# Altium schematic sheet Regulators_2.SchDoc: Regulators_2
size B; Organization: Myomo; Address1: 137 PORTLAND STREET, 4TH FLOOR; Address2: BOSTON, MA 02114; Address3: USA; SheetNumber: 3
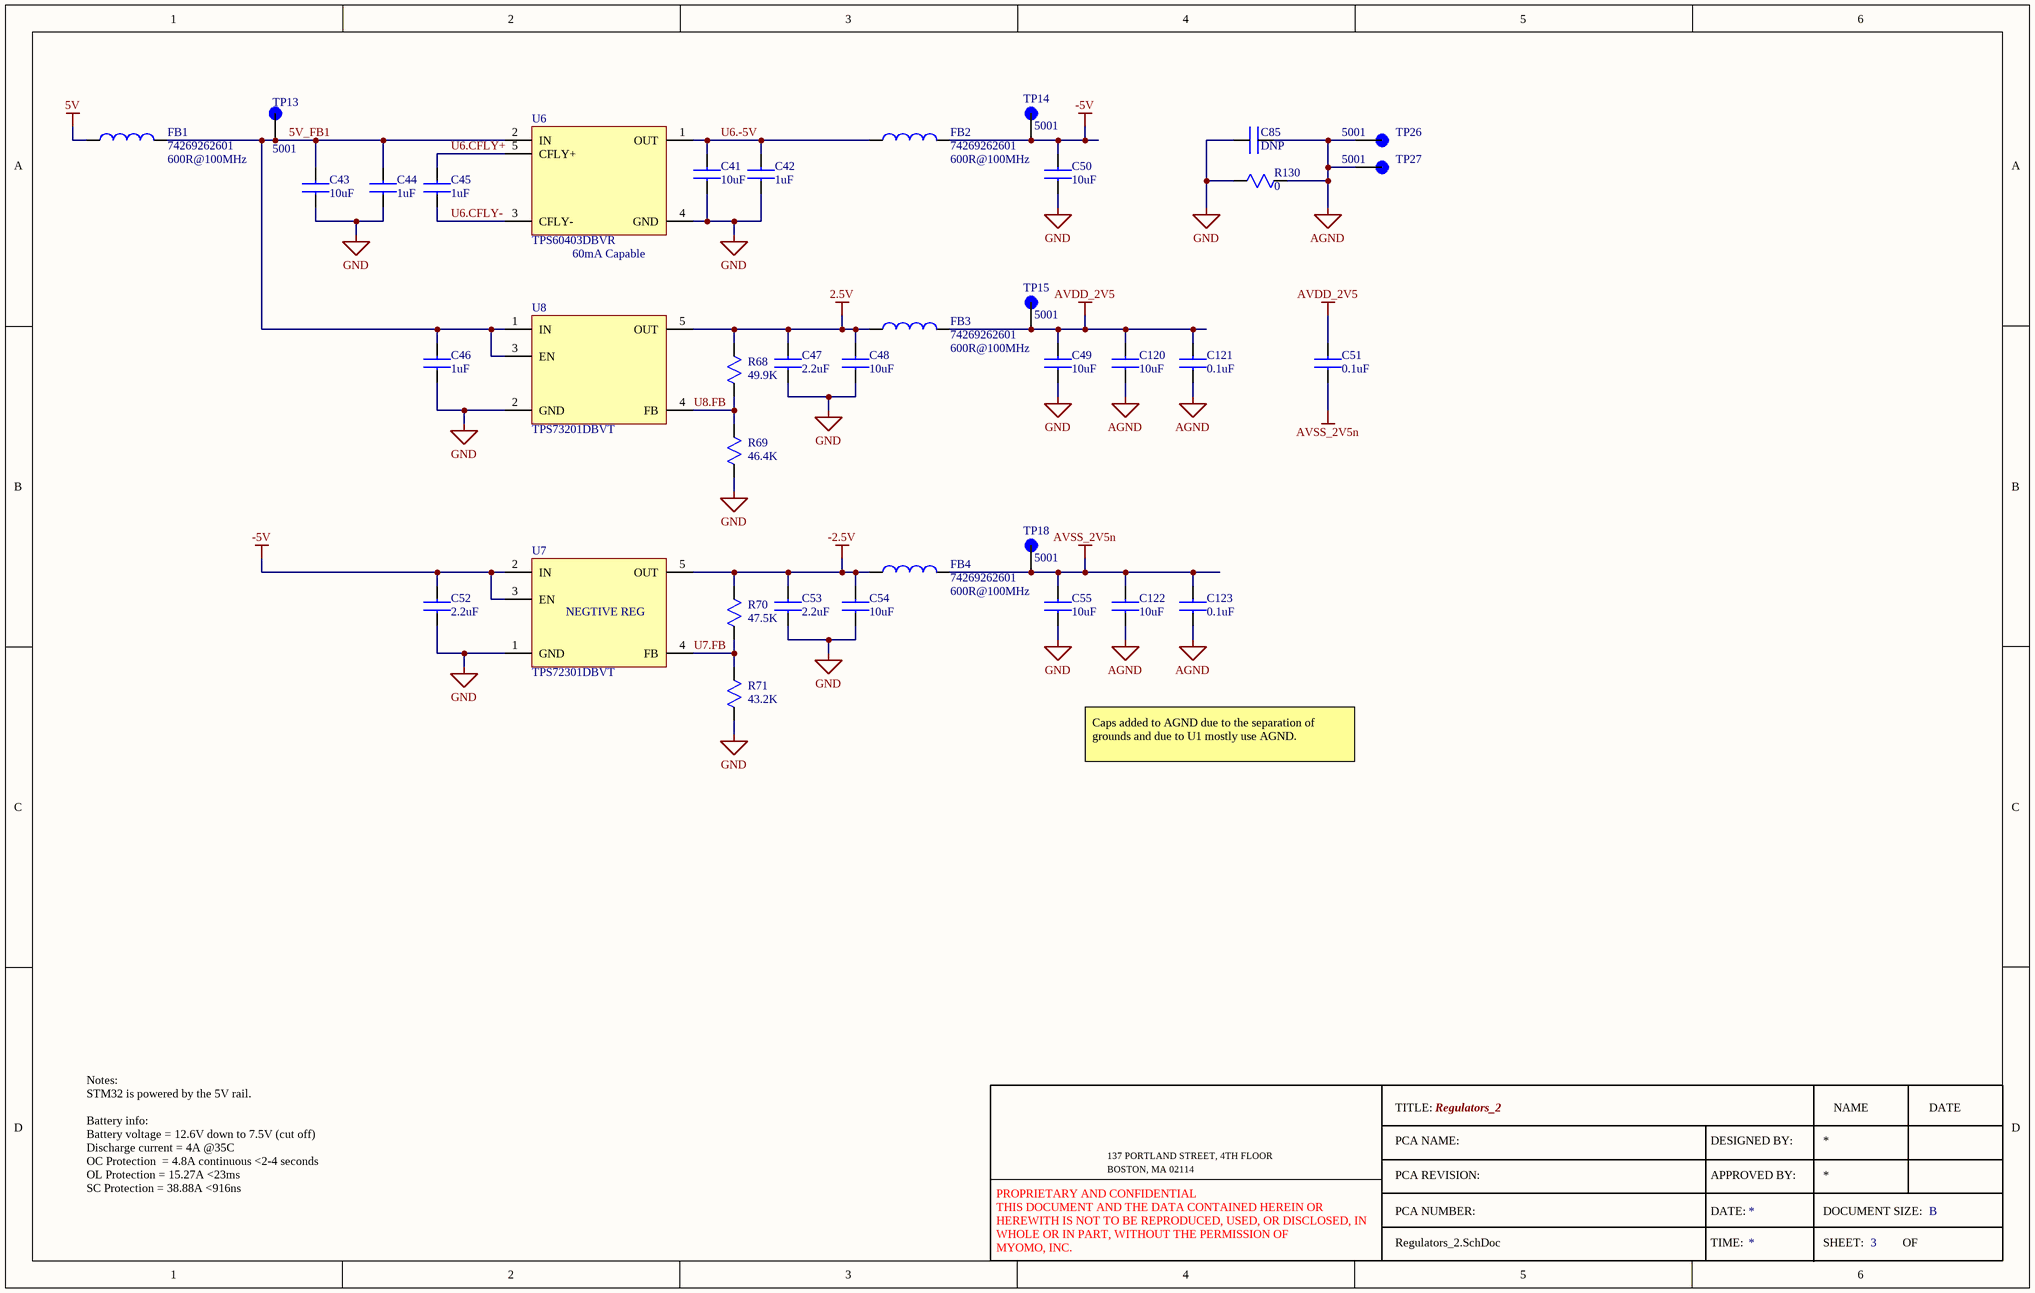
[diagram p0: Regulators_2.SchDoc]

## Parts
C41  10uF  [1210]
C42  1uF  [0603]
C43  10uF  [1210]
C44  1uF  [0603]
C45  1uF  [0603]
C46  1uF  [0603]
C47  2.2uF  [0603]
C48  10uF  [1210]
C49  10uF  [1210]
C50  10uF  [1210]
C51  0.1uF  [0603]
C52  2.2uF  [0603]
C53  2.2uF  [0603]
C54  10uF  [1210]
C55  10uF  [1210]
C85  DNP  [0603]  (no BOM)
C120  10uF  [1210]
C121  0.1uF  [0603]
C122  10uF  [1210]
C123  0.1uF  [0603]
FB1  74269262601  [0603]
FB2  74269262601  [0603]
FB3  74269262601  [0603]
FB4  74269262601  [0603]
R68  49.9K  [0603]
R69  46.4K  [0603]
R70  47.5K  [0603]
R71  43.2K  [0603]
R130  0  [0603]
TP13  5001  [TP_CLIP_BLK_5001]
TP14  5001  [TP_CLIP_BLK_5001]
TP15  5001  [TP_CLIP_BLK_5001]
TP18  5001  [TP_CLIP_BLK_5001]
TP26  5001  [TP_CLIP_BLK_5001]
TP27  5001  [TP_CLIP_BLK_5001]
U6  TPS60403DBVR  [U_TPS60403DBVR]
U7  TPS72301DBVT  [U_TPS72301DBVT_NEG]
U8  TPS73201DBVT  [U_TPS73201DBVT]

## Nets
2.5V: C47.1 C48.1 FB3.1 R68.1 U8.5(OUT)
5V: FB1.1
-2.5V: C53.1 C54.1 FB4.1 R70.1 U7.5(OUT)
-5V: C50.1 C52.1 FB2.2 TP14.TP U7.2(IN) U7.3(EN)
AGND: C85.2 C120.2 C121.2 C122.2 C123.2 R130.2 TP26.TP TP27.TP
AVDD_2V5: C49.1 C51.1 C120.1 C121.1 FB3.2 TP15.TP
AVSS_2V5n: C51.2 C55.1 C122.1 C123.1 FB4.2 TP18.TP
GND: C41.2 C42.2 C43.2 C44.2 C46.2 C47.2 C48.2 C49.2 C50.2 C52.2 C53.2 C54.2 C55.2 C85.1 R69.2 R71.2 R130.1 U6.4(GND) U7.1(GND) U8.2(GND)
5V_FB1: C43.1 C44.1 C46.1 FB1.2 TP13.TP U6.2(IN) U8.1(IN) U8.3(EN)
U6.-5V: C41.1 C42.1 FB2.1 U6.1(OUT)
U6.CFLY+: C45.1 U6.5(CFLY+)
U6.CFLY-: C45.2 U6.3(CFLY-)
U7.FB: R70.2 R71.1 U7.4(FB)
U8.FB: R68.2 R69.1 U8.4(FB)

## Notes on the sheet
- (near U6) 60mA Capable
- Caps added to AGND due to the separation of grounds and due to U1 mostly use AGND.
- Notes:
  STM32 is powered by the 5V rail.
  Battery info:
  Battery voltage = 12.6V down to 7.5V (cut off)
  Discharge current = 4A @35C
  OC Protection  = 4.8A continuous <2-4 seconds
  OL Protection = 15.27A <23ms
  SC Protection = 38.88A <916ns
- TITLE:
- NAME
- DATE
- PCA REVISION:
- PCA NAME:
- APPROVED BY:
- DESIGNED BY:
- PCA NUMBER:
- DATE:
- TIME:
- DOCUMENT SIZE:
- SHEET:
- OF
- B
- PROPRIETARY AND CONFIDENTIAL
  THIS DOCUMENT AND THE DATA CONTAINED HEREIN OR HEREWITH IS NOT TO BE REPRODUCED, USED, OR DISCLOSED, IN WHOLE OR IN PART, WITHOUT THE PERMISSION OF
  MYOMO, INC.
- (in symbol FB_0603 _600_100MHz_1.5A) 600R@100MHz
- (in symbol U_TPS72301DBVT_NEG) NEGTIVE REG

## Library data of the parts
C41 C43 C48-C50 C54 C55 C120 C122 = C_1210_CER_10uF_25V_X7R: CAP CER 10UF 25V X7R 1210; MFG: SUMSUNG; MFGPN: CL32B106KAJNNNE; Myomo PN: 201-0004
C42 C44-C46 = C_0603_CER_1uF_50V_X7R: CAP CER 1UF 50V X7R 0603; MFG: YAGEO; MFGPN: CC0603KRX7R9BB105; Myomo PN: 201-0006
C47 C52 C53 = C_0603_CER_2.2uF_50V_X5R: CAP CER 2.2UF 50V X5R 0603; MFG: SAMSUNG; MFGPN: CL10A225KB8NNNC; Myomo PN: 201-0012
C51 C121 C123 = C_0603_CER_0.1uF_100V_X7R: CAP CER 0.1UF 100V X7R 0603; MFG: SAMSUNG; MFGPN: CL10B104KC8NNNC; Myomo PN: 201-0005
C85 = C_0603_DNP: CAP CER 0603 DNP
FB1-FB4 = FB_0603 _600_100MHz_1.5A: 600 Ohms @ 100 MHz 1 Power Line Ferrite Bead 0603 (1608 Metric) 1.5A 100mOhm; MFG: Wurth Elektronik; Myomo PN: 202-0001; MFGPN: 74269262601
R68 = R_0603_49.9K_1%_1/10W: RES 49.9K OHM 1% 1/10W 0603; MFG: YAGEO; MFGPN: RC0603FR-0749K9L; Myomo PN: 200-0009
R69 = R_0603_46.4K_1%_1/10W: RES 46.4K OHM 1% 1/10W 0603; MFG: YAGEO; MFGPN: RC0603FR-0746K4L; Myomo PN: 200-0013
R70 = R_0603_47.5K_1%_1/10W: RES 47.5K OHM 1% 1/10W 0603; MFG: YAGEO; MFGPN: RC0603FR-0747K5L; Myomo PN: 200-0014
R71 = R_0603_43.2K_1%_1/10W: RES 43.2K OHM 1% 1/10W 0603; MFG: YAGEO; MFGPN: RC0603FR-1343K2L; Myomo PN: 200-0015
R130 = R_0603_0: RES 0 OHM JUMPER 1/10W 0603; MFG: YAGEO; MFGPN: RC0603FR-070RL; Myomo PN: 200-0007
TP13-TP15 TP18 TP26 TP27 = TP_CLIP_BLK_5001: PC TEST POINT MINIATURE BLACK; MFG: Keystone Electronics; Myomo PN: 213-0001; MFGPN: 5001
U6 = U_TPS60403DBVR: IC REG CHG PUMP INV 60MA SOT23-5; MFG: TI; Myomo PN: 204-0007; MFGPN: TPS60403DBVR
U7 = U_TPS72301DBVT_NEG: IC REG LIN NEG ADJ 200MA SOT23-5; MFG: TI; Myomo PN: 204-0008; MFGPN: TPS72301DBVT
U8 = U_TPS73201DBVT: IC REG LIN POS ADJ 250MA SOT23-5; MFG: TI; Myomo PN: 204-0009; MFGPN: TPS73201DBVT